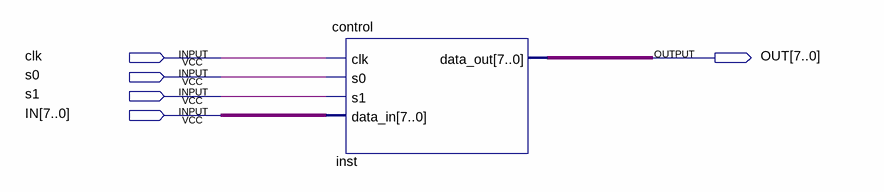
[diagram p0: schematic sheet]
// Quartus schematic move8.bdf as structural Verilog: 1 symbols, 5 pins
module move8 (
  input  clk,
  input  s0,
  input  s1,
  input  [7:0] IN,
  output [7:0] OUT
);

  control inst (.clk(clk), .s0(s0), .s1(s1), .data_in(IN), .data_out(OUT));
endmodule
